# EAGLE design blink1_v1a (EAGLE 5.11)
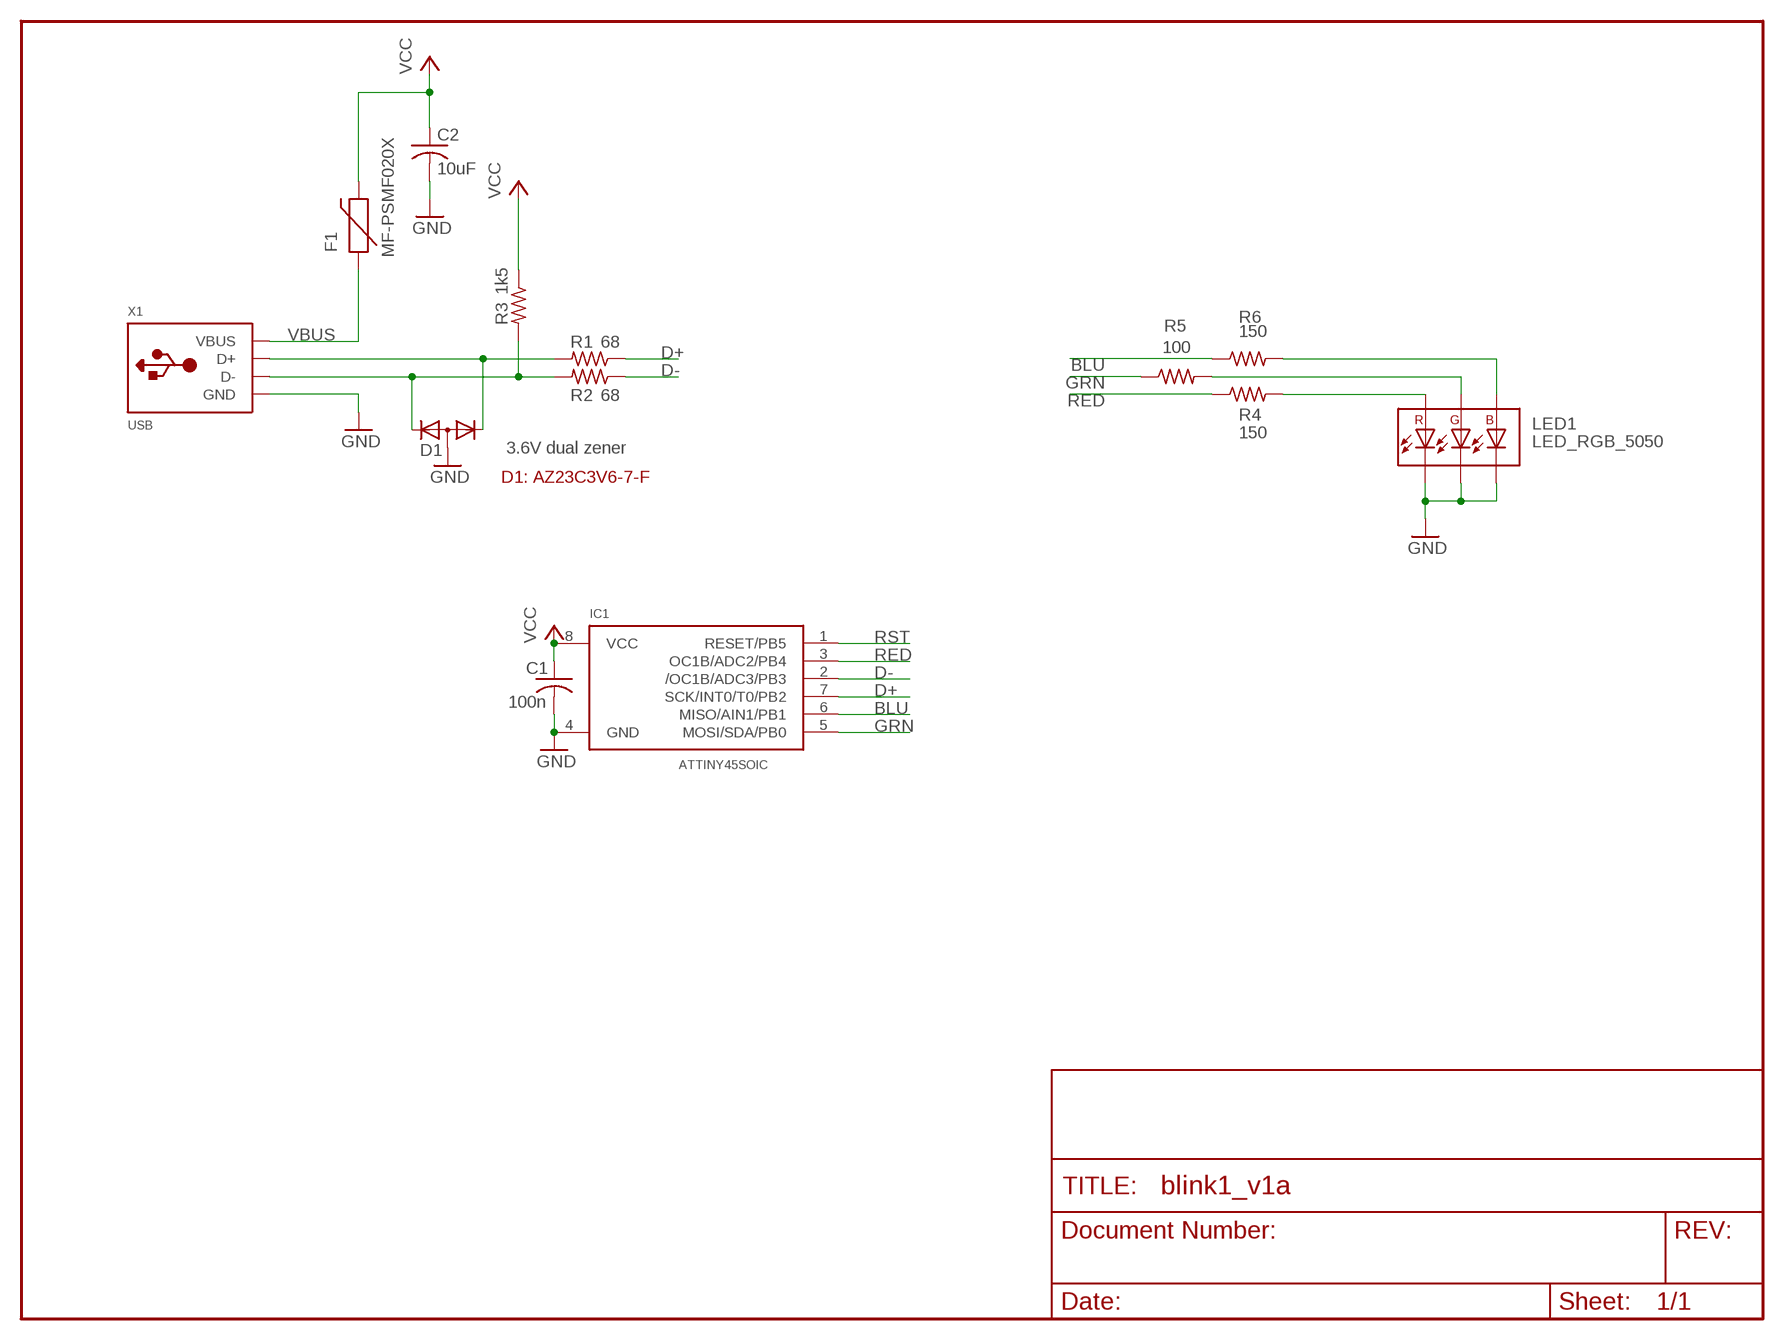
[diagram p0: schematic, sheet 1]

## Parts
C1  100n  C-USC0603  [C0603]
C2  10uF  C-USC0603  [C0603]
D1  3.6V dual zener  DIODE-2CA|ACSOT23  [SOT23]
F1  MF-PSMF020X  PTC0805  [0805]
IC1  ATTINY45SOIC  [SO08-EIAJ]
LED1  LED_RGB_5050  [LED_5050]
R1  68  R-US_R0603  [R0603]
R2  68  R-US_R0603  [R0603]
R3  1k5  R-US_R0603  [R0603]
R4  150  R-US_R0603  [R0603]
R5  100  R-US_R0603  [R0603]
R6  150  R-US_R0603  [R0603]
X1  USB  [MOLEX-48037-1000]

## Nets
BLU: IC1.6(MISO/AIN1/PB1) R6.1
D+: IC1.7(SCK/INT0/T0/PB2) R1.1
D-: IC1.2(/OC1B/ADC3/PB3) R2.1
GND: C1.2 C2.2 D1.3(A) IC1.4(GND) LED1.P$4(C2) LED1.P$5(C1) LED1.P$6(C0) X1.4(GND)
GRN: IC1.5(MOSI/SDA/PB0) R5.1
N$4: D1.1(K1) R1.2 X1.3(D+)
N$5: D1.2(K2) R2.2 R3.2 X1.2(D-)
RBLU: LED1.P$3(A2) R6.2
RED: IC1.3(OC1B/ADC2/PB4) R4.1
RGRN: LED1.P$2(A1) R5.2
RRED: LED1.P$1(A0) R4.2
RST: IC1.1(RESET/PB5)
VBUS: F1.1 X1.1(VBUS)
VCC: C1.1 C2.1 F1.2 IC1.8(VCC) R3.1

## Notes on the sheet
- D1: AZ23C3V6-7-F

## Library data of the parts
C1 C2 = rcl:C-US: CAPACITOR, American symbol
D1 = diode:DIODE-2CA|AC: Dual DIODE Cathode-Anode|Anode-Cathode
F1 = todstuff:PTC
IC1 = todstuff:ATTINY45
LED1 = todstuff:LED_RGB_5050
R1-R6 = rcl:R-US_: RESISTOR, American symbol
X1 = todstuff:USB

## Board
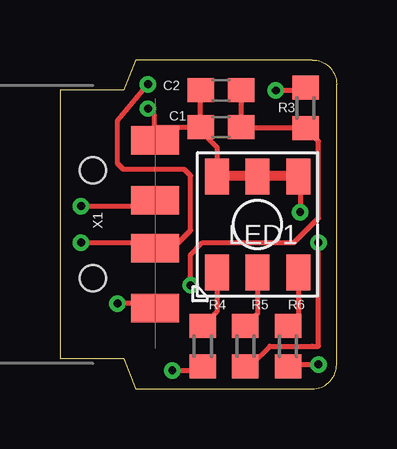
[diagram p1: board, top side]
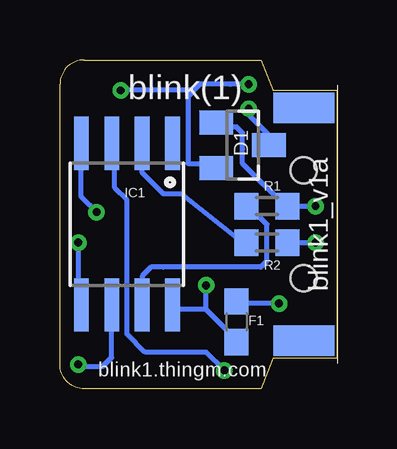
[diagram p2: board, bottom side, seen from below]

Size 11.55 x 13.72 mm. Coordinates in mm from the lower left corner, seen from the top.
Outline: 0,1.27 2.66,1.27 3.16,0 10.53,0 arc90 11.55,1.02 11.55,12.7 arc90 10.53,13.72 3.16,13.72 2.66,12.45 0,12.45 0,1.27
Copper layers (1*16): Top 0.0356mm / dielectric 1.5011mm / Bottom 0.0356mm
Design rules "LaenPCBOrder *": minimum track width 8mil, minimum drill 13mil, track to track 6mil, track to pad 8mil, pad to pad 8mil, via to via 8mil, smd to smd 6mil, copper to edge 15mil, drill to drill 8mil, minimum pad ring 7mil, minimum via ring 7mil, stop-mask expansion 4mil, vias tented up to drill 25mil, thermal gap 10mil

### Footprints (pad centres in the part's own frame; a part is rotated, then mirrored left to right if it is on the bottom)
C0603 = smd 1.1 x 1: 1 -0.85,0; 2 0.85,0
SOT23 = smd 1 x 1.4: 1 -0.95,-1.1; 2 0.95,-1.1; 3 0,1.1
0603 = smd 1.1 x 1: 1 -0.85,0; 2 0.85,0
SO08-EIAJ = smd 0.61 x 2.21: 1 -1.905,-3.378; 2 -0.635,-3.378; 3 0.635,-3.378; 4 1.905,-3.378; 5 1.905,3.353; 6 0.635,3.353; 7 -0.635,3.353; 8 -1.905,3.353
LED_5050 = smd 1 x 1.5: P$1 1.7,2; P$2 0,2; P$3 -1.7,2; P$4 -1.7,-2; P$5 0,-2; P$6 1.7,-2
R0603 = smd 1 x 1.1: 1 -0.85,0; 2 0.85,0
MOLEX-48037-1000 = smd 2 x 1.2: 1 2.6,-3.5; 2 2.6,-1; 3 2.6,1; 4 2.6,3.5 | smd 2.54 x 1.27 bottom: P$1 0,4.85; P$2 0,-4.85 | hole 1.1: 0,2.25; 0,-2.25

### Placement (x,y rotation side)
C1  6.72,10.92 180 top
C2  6.72,12.45 180 top
D1  3.93,10.16 270 bottom
F1  PTC0603  [0603]  4.18,2.79 270 bottom
IC1  8.75,6.86 180 bottom
LED1  8.24,6.86 180 top
R1  2.91,7.62 0 bottom
R2  2.91,6.1 0 bottom
R3  10.24,11.72 90 top
R4  100  [R0603]  5.96,1.78 90 top
R5  7.74,1.78 90 top
R6  60  [R0603]  9.51,1.78 90 top
X1  1.38,6.86 0 top

### Tracks (layer width: path | path; a pad name or v marks a point on that pad's centre or on a via)
BLU  (via drill 0.33)
  Top 0.203: v10.78,1.02 9.77,1.02 R6.1
  Bottom 0.203: IC1.6 9.39,1.31 9.77,0.93 10.95,0.93 v10.78,1.02
D+
  Bottom 0.203: R1.1 3.67,7.62 2.91,6.86 2.91,5.33 3.16,5.08 7.23,5.08 7.74,5.08 8.12,4.7 IC1.7
D-
  Bottom 0.203: R2.1 3.93,6.1 6.47,8.13 7.23,8.13 7.99,8.89 8.12,9.02 IC1.2
GND  (via drill 0.33)
  Top 0.203: v3.67,11.68 3.93,11.43 3.93,10.92 | 3.93,10.92 3.93,10.41 X1.4 3.93,10.92 | 3.93,10.92 5.7,10.92 | LED1.P$6 6.72,8.89 | 9.77,8.89 LED1.P$4 10.02,8.64 v10.02,7.37 | LED1.P$6 6.47,8.89 | 5.7,10.92 6.54,10.08 LED1.P$6 | 5.7,10.92 C1.2 5.87,12.35 C2.2 | 8.24,8.89 LED1.P$5 8.24,8.89
  Top 0.406: 6.72,8.89 8.24,8.89 9.77,8.89
  Bottom 0.203: v3.67,11.68 3.67,11.43 2.91,10.67 2.91,10.16 D1.3 | 10.53,7.87 v10.02,7.37 10.66,8 IC1.4
GRN  (via drill 0.33)
  Top 0.203: v10.78,6.1 10.78,1.78 10.53,1.78 8.75,1.78 7.99,1.02 R5.1
  Bottom 0.203: v10.78,6.1 10.78,3.81 10.78,3.56 IC1.5
N$4  (via drill 0.33)
  Top 0.203: v0.88,7.62 3.93,7.62 X1.3
  Bottom 0.203: 4.94,10.92 D1.1 4.84,10.92 4.18,10.92 3.93,10.67 3.93,10.01 3.93,9.4 2.15,7.62 R1.2 1.89,7.62 v0.88,7.62
N$5  (via drill 0.33)
  Top 0.203: v0.88,6.1 3.93,6.1 X1.2 4.22,6.1 4.94,6.1 5.45,6.6 5.45,8.89 5.2,9.14 2.66,9.14 2.4,9.4 2.4,11.18 v3.67,12.7 | v9.01,12.45 9.77,12.45 R3.2
  Bottom 0.203: v0.88,6.1 1.89,6.1 R2.2 | D1.2 5.2,9.4 6.21,9.4 6.21,12.19 5.83,12.57 | v3.67,12.7 4.43,12.7 5.7,12.7 5.83,12.57 | v9.01,12.45 5.96,12.45 5.83,12.57
RBLU
  Top 0.203: R6.2 9.94,3.06 LED1.P$3
RED  (via drill 0.33)
  Top 0.203: v4.69,0.76 6.21,0.76 R4.1
  Bottom 0.203: v4.69,0.76 5.45,1.52 7.99,1.52 8.75,2.29 8.75,7.87 9.26,8.38 9.26,10.16 IC1.3
RGRN
  Top 0.203: R5.2 8.24,3.14 LED1.P$2
RRED
  Top 0.203: R4.2 6.54,3.21 LED1.P$1
VBUS  (via drill 0.33)
  Top 0.203: v2.4,3.56 3.93,3.56 X1.1
  Bottom 0.203: v2.4,3.56 4.18,3.56 F1.1
VCC  (via drill 0.33)
  Top 0.203: v5.45,4.32 5.45,5.59 5.96,6.1 9.77,6.1 10.78,7.11 10.78,10.33 R3.1 7.63,10.87 C1.1 7.57,12.35 C2.1
  Bottom 0.203: 5.45,3.3 4.18,2.03 F1.2 | 5.45,3.3 6.72,3.3 IC1.8 | 5.45,3.3 v5.45,4.32

### Text on the board
bPlace: blink(1) | blink1_v1a | blink1.thingm.com